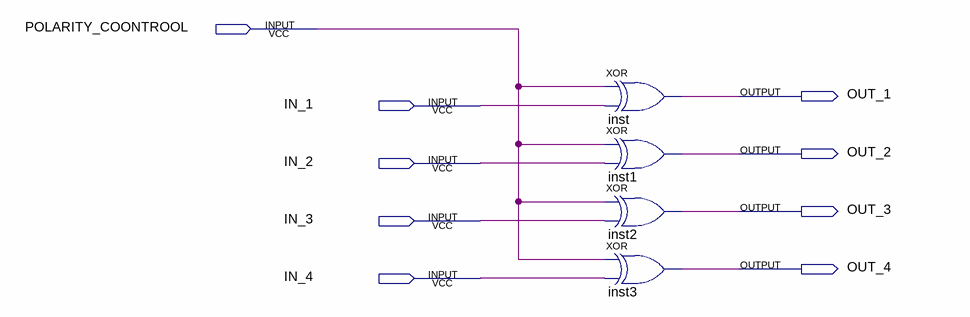
[diagram p0: schematic sheet]
// Quartus schematic switch_polarity_inverter.bdf as structural Verilog: 4 symbols, 9 pins
module switch_polarity_inverter (
  input  POLARITY_COONTROOL,
  input  IN_1,
  input  IN_2,
  input  IN_3,
  input  IN_4,
  output OUT_1,
  output OUT_2,
  output OUT_3,
  output OUT_4
);

  xor inst (OUT_1, POLARITY_COONTROOL, IN_1);
  xor inst1 (OUT_2, POLARITY_COONTROOL, IN_2);
  xor inst2 (OUT_3, POLARITY_COONTROOL, IN_3);
  xor inst3 (OUT_4, POLARITY_COONTROOL, IN_4);
endmodule
